# Altium schematic sheet BBB_SCH2.SchDoc
size B; Organization: CWRUbotix; Address1: 10900 Euclid Avenue; Address2: Cleveland, OH 44106; Address3: USA
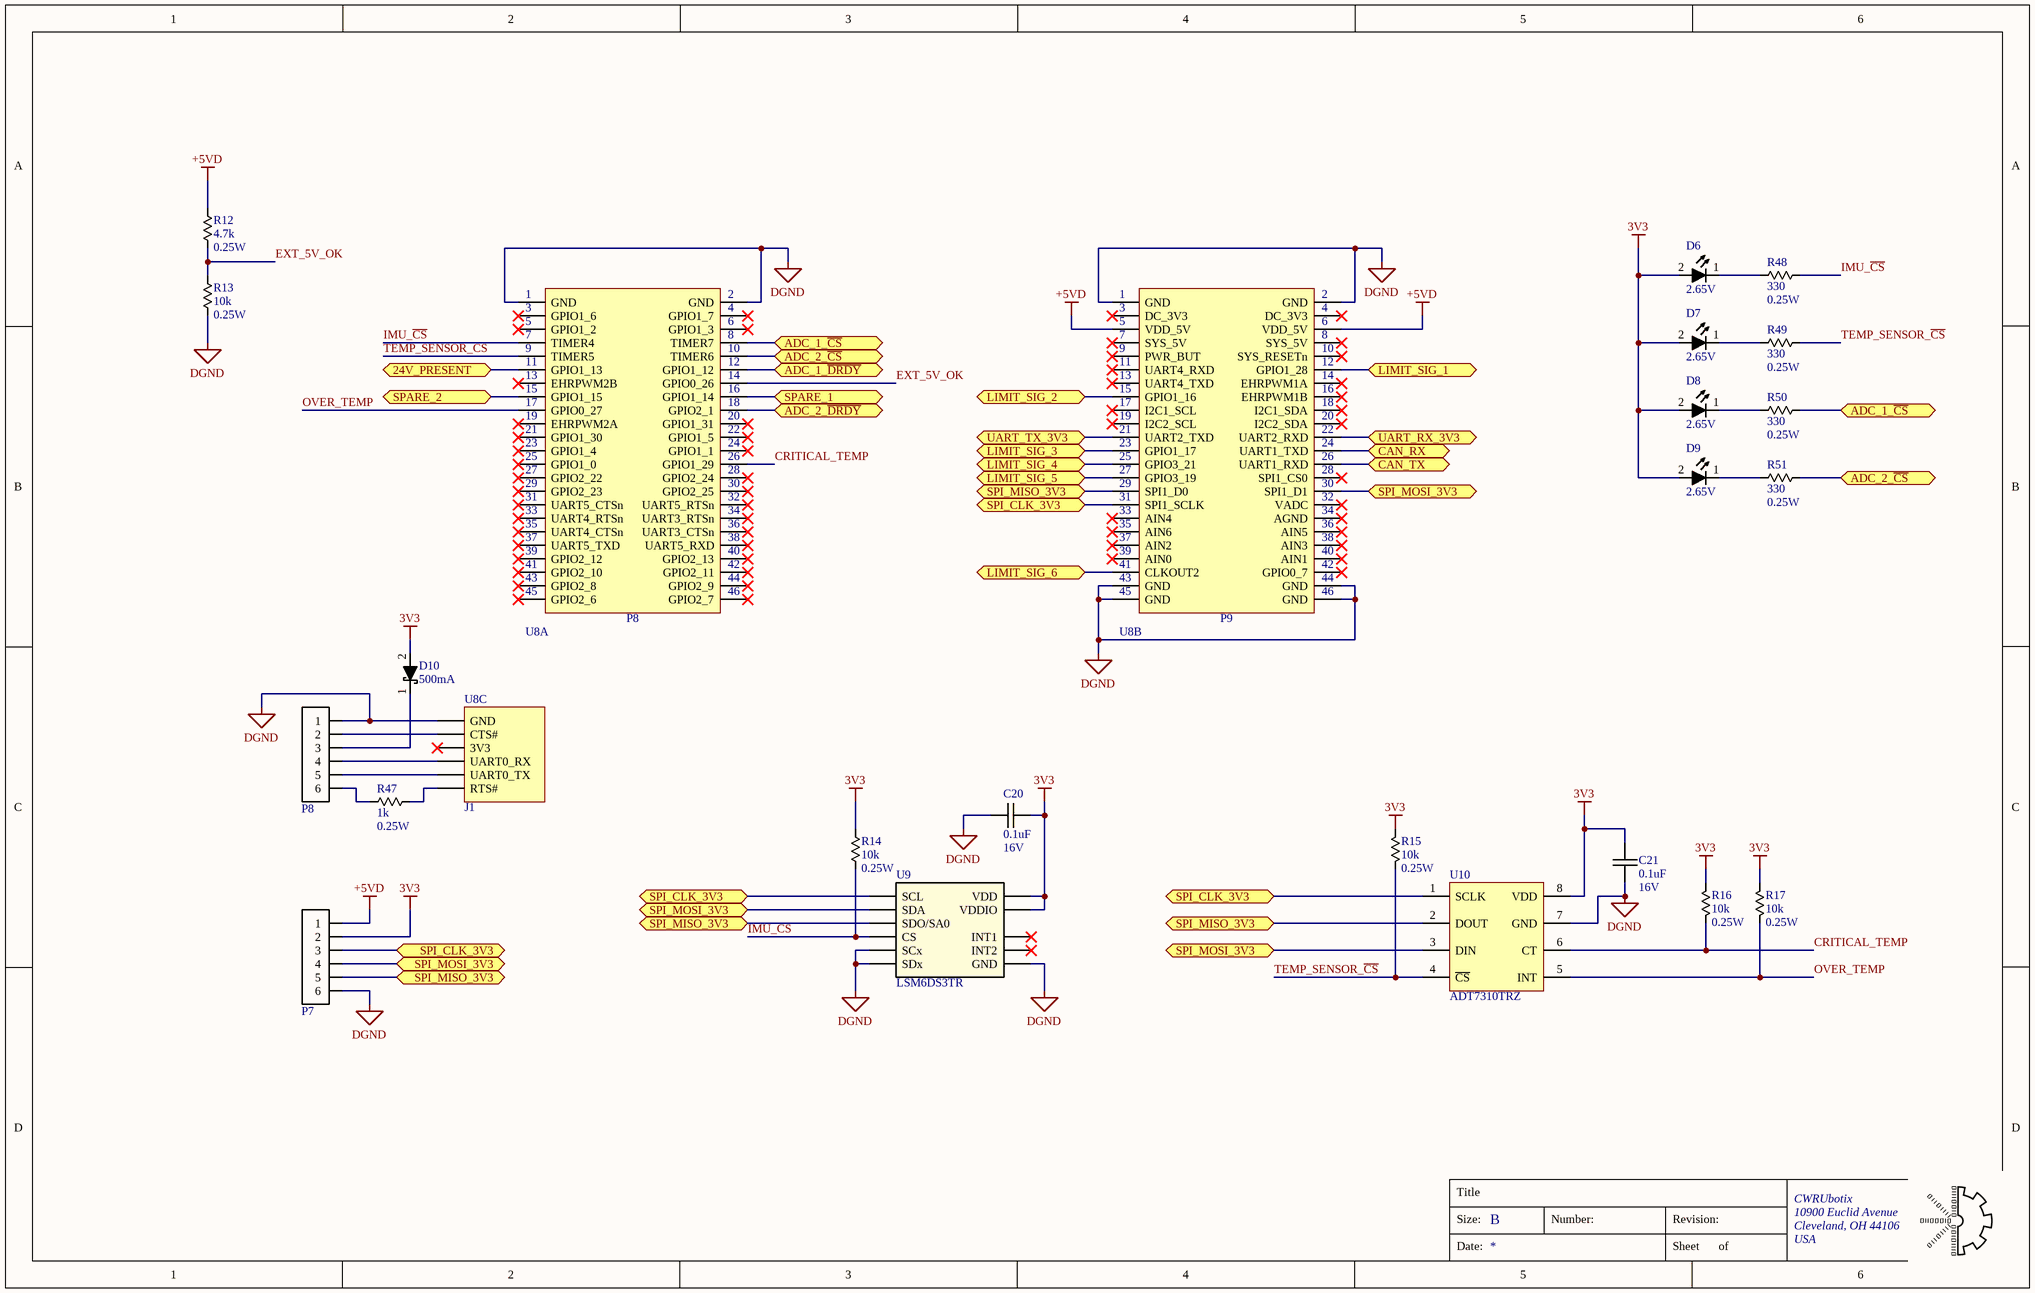
[diagram p0: BBB_SCH2.SchDoc]

## Parts
C20  Capacitance: 0.1uF  Voltage Rating: 16V  [chip_0603]  (hidden comment: cap_single_np)
C21  Capacitance: 0.1uF  Voltage Rating: 16V  [chip_0603]  (hidden comment: cap_single_np)
D6  Forward Voltage: 2.65V  [chip_0603]  (hidden comment: diode_4)
D7  Forward Voltage: 2.65V  [chip_0603]  (hidden comment: diode_4)
D8  Forward Voltage: 2.65V  [chip_0603]  (hidden comment: diode_4)
D9  Forward Voltage: 2.65V  [chip_0603]  (hidden comment: diode_4)
D10  Current Rating: 500mA  [sod323_0]  (hidden comment: diode_2)
P7  conn-6x1_0  [HDDR_6X1_0]  (value not drawn)
P8  conn-6x1_0  [SOCK_6x1_0]  (value not drawn)
R12  Resistance: 4.7k  Power Rating: 0.25W  [chip_0603]  (hidden comment: res_single)
R13  Resistance: 10k  Power Rating: 0.25W  [chip_0603]  (hidden comment: res_single)
R14  Resistance: 10k  Power Rating: 0.25W  [chip_0603]  (hidden comment: res_single)
R15  Resistance: 10k  Power Rating: 0.25W  [chip_0603]  (hidden comment: res_single)
R16  Resistance: 10k  Power Rating: 0.25W  [chip_0603]  (hidden comment: res_single)
R17  Resistance: 10k  Power Rating: 0.25W  [chip_0603]  (hidden comment: res_single)
R47  Resistance: 1k  Power Rating: 0.25W  [chip_0603]  (hidden comment: res_single)
R48  Resistance: 330  Power Rating: 0.25W  [chip_0603]  (hidden comment: res_single)
R49  Resistance: 330  Power Rating: 0.25W  [chip_0603]  (hidden comment: res_single)
R50  Resistance: 330  Power Rating: 0.25W  [chip_0603]  (hidden comment: res_single)
R51  Resistance: 330  Power Rating: 0.25W  [chip_0603]  (hidden comment: res_single)
U8  BBB  [BEAGLEBONE]  (value not drawn)  (parts A,B,C of 3)
U9  Manufacturer PN: LSM6DS3TR  [LGA14]  (hidden comment: LSM6DS3)
U10  Manufacturer PN: ADT7310TRZ  [SO-8]  (hidden comment: ADT7310)

## Ports
24V_PRESENT (bidir), ADC_1_~{CS} (bidir), ADC_1_~{DRDY} (bidir), ADC_2_~{CS} (bidir), ADC_2_~{DRDY} (bidir), CAN_RX (bidir), CAN_TX (bidir), LIMIT_SIG_1 (bidir), LIMIT_SIG_2 (bidir), LIMIT_SIG_3 (bidir), LIMIT_SIG_4 (bidir), LIMIT_SIG_5 (bidir), LIMIT_SIG_6 (bidir), SPARE_1 (bidir), SPARE_2 (bidir), SPI_CLK_3V3 (bidir), SPI_MISO_3V3 (bidir), SPI_MOSI_3V3 (bidir), UART_RX_3V3 (bidir), UART_TX_3V3 (bidir)

## Nets
3V3: C20.2 C21.2 D6.2 D7.2 D8.2 D9.2 D10.2 P7.2 R14.1 R15.1 R16.1 R17.1 U9.5(VDDIO) U9.8(VDD) U10.8(VDD)
+5VD: P7.1 R12.2 U8.51(VDD_5V) U8.52(VDD_5V)
DGND: C20.1 C21.1 P7.6 P8.1 R13.2 U8.1(GND) U8.2(GND) U8.47(GND) U8.48(GND) U8.89(GND) U8.90(GND) U8.91(GND) U8.92(GND) U8.J1_1(GND) U9.2(SDx) U9.3(SCx) U9.6(GND) U10.7(GND)
24V_PRESENT: U8.11(GPIO1_13) ; port 24V_PRESENT
ADC_1_~{CS}: R50.2 U8.8(TIMER7) ; port ADC_1_~{CS}
ADC_1_~{DRDY}: U8.12(GPIO1_12) ; port ADC_1_~{DRDY}
ADC_2_~{CS}: R51.2 U8.10(TIMER6) ; port ADC_2_~{CS}
ADC_2_~{DRDY}: U8.18(GPIO2_1) ; port ADC_2_~{DRDY}
CAN_RX: U8.70(UART1_TXD) ; port CAN_RX
CAN_TX: U8.72(UART1_RXD) ; port CAN_TX
CRITICAL_TEMP: R16.2 U8.26(GPIO1_29) U10.6(CT)
EXT_5V_OK: R12.1 R13.1 U8.14(GPIO0_26)
IMU_~{CS}: R14.2 R48.2 U8.7(TIMER4) U9.12(CS)
LIMIT_SIG_1: U8.58(GPIO1_28) ; port LIMIT_SIG_1
LIMIT_SIG_2: U8.61(GPIO1_16) ; port LIMIT_SIG_2
LIMIT_SIG_3: U8.69(GPIO1_17) ; port LIMIT_SIG_3
LIMIT_SIG_4: U8.71(GPIO3_21) ; port LIMIT_SIG_4
LIMIT_SIG_5: U8.73(GPIO3_19) ; port LIMIT_SIG_5
LIMIT_SIG_6: U8.87(CLKOUT2) ; port LIMIT_SIG_6
OVER_TEMP: R17.2 U8.17(GPIO0_27) U10.5(INT)
SPARE_1: U8.16(GPIO1_14) ; port SPARE_1
SPARE_2: U8.15(GPIO1_15) ; port SPARE_2
SPI_CLK_3V3: P7.3 U8.77(SPI1_SCLK) U9.13(SCL) U10.1(SCLK) ; port SPI_CLK_3V3
SPI_MISO_3V3: P7.5 U8.75(SPI1_D0) U9.1(SDO/SA0) U10.2(DOUT) ; port SPI_MISO_3V3
SPI_MOSI_3V3: P7.4 U8.76(SPI1_D1) U9.14(SDA) U10.3(DIN) ; port SPI_MOSI_3V3
TEMP_SENSOR_~{CS}: R15.2 R49.2 U8.9(TIMER5) U10.4(~{CS})
UART_RX_3V3: U8.68(UART2_RXD) ; port UART_RX_3V3
UART_TX_3V3: U8.67(UART2_TXD) ; port UART_TX_3V3
NetD6_1: D6.1 R48.1
NetD7_1: D7.1 R49.1
NetD8_1: D8.1 R50.1
NetD9_1: D9.1 R51.1
NetD10_1: D10.1 P8.3
NetP8_2: P8.2 U8.J1_2(CTS#)
NetP8_4: P8.4 U8.J1_4(UART0_RX)
NetP8_5: P8.5 U8.J1_5(UART0_TX)
NetP8_6: P8.6 R47.1
NetR47_2: R47.2 U8.J1_6(RTS#)

Not connected (* = marked no-connect by the designer): U8 3(GPIO1_6)* 4(GPIO1_7)* 5(GPIO1_2)* 6(GPIO1_3)* 13(EHRPWM2B)* 19(EHRPWM2A)* 20(GPIO1_31)* 21(GPIO1_30)* 22(GPIO1_5)* 23(GPIO1_4)* 24(GPIO1_1)* 25(GPIO1_0)* 27(GPIO2_22)* 28(GPIO2_24)* 29(GPIO2_23)* 30(GPIO2_25)* 31(UART5_CTSn)* 32(UART5_RTSn)* 33(UART4_RTSn)* 34(UART3_RTSn)* 35(UART4_CTSn)* 36(UART3_CTSn)* 37(UART5_TXD)* 38(UART5_RXD)* 39(GPIO2_12)* 40(GPIO2_13)* 41(GPIO2_10)* 42(GPIO2_11)* 43(GPIO2_8)* 44(GPIO2_9)* 45(GPIO2_6)* 46(GPIO2_7)* 49(DC_3V3)* 50(DC_3V3)* 53(SYS_5V)* 54(SYS_5V)* 55(PWR_BUT)* 56(SYS_RESETn)* 57(UART4_RXD)* 59(UART4_TXD)* 60(EHRPWM1A)* 62(EHRPWM1B)* 63(I2C1_SCL)* 64(I2C1_SDA)* 65(I2C2_SCL)* 66(I2C2_SDA)* 74(SPI1_CS0)* 78(VADC)* 79(AIN4)* 80(AGND)* 81(AIN6)* 82(AIN5)* 83(AIN2)* 84(AIN3)* 85(AIN0)* 86(AIN1)* 88(GPIO0_7)* J1_3(3V3)*; U9 4(INT1)* 7(GND) 9(INT2)* 10(NC) 11(NC)

## Notes on the sheet
- Title
- Size:
- B
- Number:
- Revision:
- Date:
- Sheet
- of
- (in symbol MISC-00020, part A) P8
- (in symbol MISC-00020, part B) P9
- (in symbol MISC-00020, part C) J1

## Library data of the parts
C20 C21 = CAP-00542: CAP, 0.1uF, ±10%, 16V, X7R, 0603; Manufacturer: Murata; Tolerance: ±10%; Part Number: CAP-00542; Type: X7R
D6-D9 = DIO-00049: LED, Blue, 0603, Low current, HELI2 Series; Manufacturer: Kingbright; Manufacturer PN: APT1608LVBC/D; Reverse Breakdown Voltage: 5V; Current Rating: 30mA; Power Rating: 120mW; Type: LED; Part Number: DIO-00049; Cost: 0.58
D10 = DIO-00000: Dio Shtky, 500mA, 0.62V, 30V, SOD-323; Manufacturer: ON Semi; Manufacturer PN: NSR0530HT1G; Forward Voltage: 620mV; Type: Schottky; Reverse Breakdown Voltage: 30V; Part Number: DIO-00000
P7 = CONN-00008: Header 6x1, 0.1"; Positions per level: 6; Levels: 1; Part Number: CONN-00008
P8 = CONN-00046: Female Socket, 6x1, 0.1"; Manufacturer: Samtec; Manufacturer PN: SSW-106-01-F-S; Positions per level: 6; Levels: 1; Part Number: CONN-00046; Type: Socket; Cost: 0.8
R12 = RES-00470: RES SMD 4.7K OHM 1% 1/4W 0603; Manufacturer: Panasonic; Manufacturer PN: ERJ-PA3F4701V; Tolerance: 1%; Part Number: RES-00470
R13-R17 = RES-00306: RES SMD 10K OHM 1% 1/4W 0603; Manufacturer: Panasonic; Manufacturer PN: ERJ-PA3F1002V; Tolerance: 1%; Part Number: RES-00306; Cost: 0.144
R47 = RES-00360: RES SMD 1K OHM 1% 1/4W 0603; Manufacturer: Panasonic; Manufacturer PN: ERJ-PA3F1001V; Tolerance: 1%; Part Number: RES-00360
R48-R51 = RES-00221: RES SMD 330 OHM 1% 1/4W 0603; Manufacturer: Panasonic; Manufacturer PN: ERJ-PA3F3300V; Tolerance: 1%; Part Number: RES-00221
U8 = MISC-00020: Beaglebone Black; Manufacturer PN: BEAGLEBONE; Part Number: MISC-00020
U9 = MISC-00012: Accel & Gyro, 3-Axis, SPI/I2C; Manufacturer: STM; Part Number: MISC-00012; Cost: 3
U10 = ANLG-00048: IC, 0.5°C Accurate 16-bit Digital SPI Temperature Sensor, SOIC-8, ADT7310; Manufacturer: Analog Devices; Part Number: ANLG-00048; Cost: 3.93